# Altium schematic sheet KEY_V0.01_160620.SchDoc
size A4
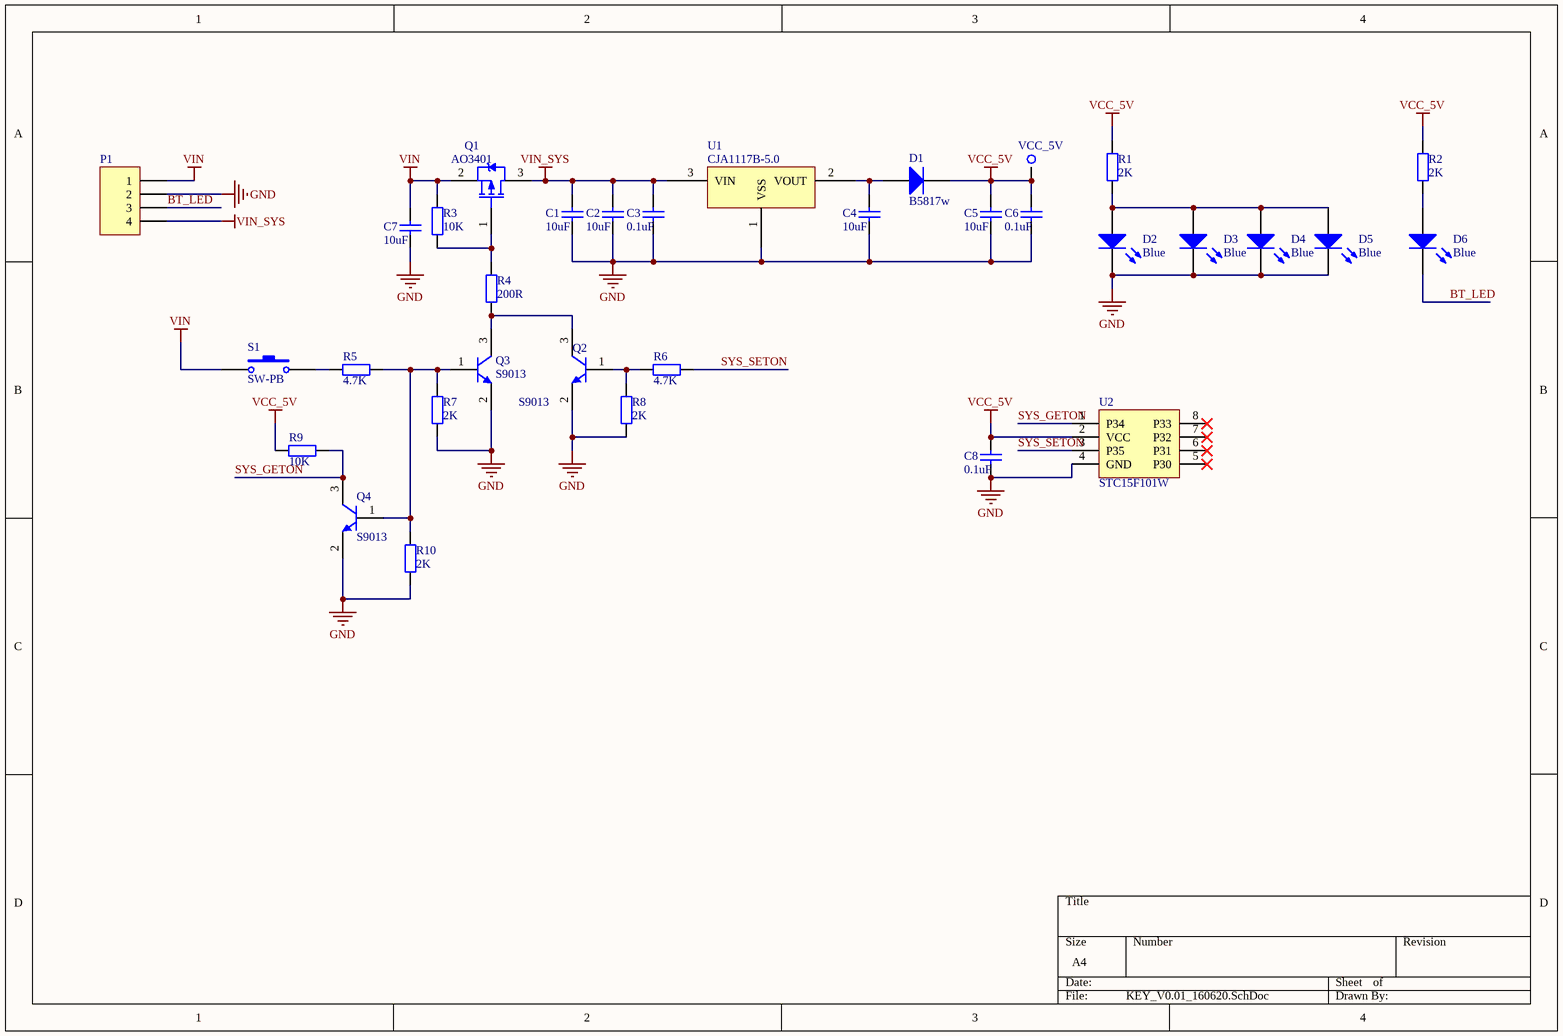
[diagram p0: KEY_V0.01_160620.SchDoc]

## Parts
C1  10uF  [C0603]
C2  10uF  [C0603]
C3  0.1uF  [C0603]
C4  10uF  [C0603]
C5  10uF  [C0603]
C6  0.1uF  [C0603]
C7  10uF  [C0603]
C8  0.1uF  [C0603]
D1  B5817w  [SOD-123]
D2  Blue  [D0603]
D3  Blue  [D0603]
D4  Blue  [D0603]
D5  Blue  [D0603]
D6  Blue  [D0603]
P1  Download_pad  [HEADER1X4/2.0MM_1]  (value not drawn)
Q1  AO3401  [SOT-23-3]
Q2  S9013  [SOT-23]
Q3  S9013  [SOT-23]
Q4  S9013  [SOT-23]
R1  2K  [R0603]
R2  2K  [R0603]
R3  10K  [R0603]
R4  200R  [R0603]
R5  4.7K  [R0603]
R6  4.7K  [R0603]
R7  2K  [R0603]
R8  2K  [R0603]
R9  10K  [R0603]
R10  2K  [R0603]
S1  SW-PB  [SW-TS-021]
U1  CJA1117B-5.0  [SOT-89-3L]
U2  STC15F101W  [SOP-8N]
VCC_5V  *  [Testpoint 1mm]  (value not drawn)

## Nets
GND: C1.2 C2.2 C3.2 C4.2 C5.2 C6.2 C7.2 C8.2 D2.2(K) D3.2(K) D4.2(K) D5.2(K) P1.2 Q2.2(E) Q3.2(E) Q4.2(E) R7.1 R8.1 R10.1 U1.1(VSS) U2.4(GND)
VCC_5V: C5.1 C6.1 C8.1 D1.2(K) R1.2 R2.1 R9.2 U2.2(VCC) VCC_5V.1
VIN: C7.1 P1.1 Q1.2(S) R3.2 S1.1
VIN_SYS: C1.1 C2.1 C3.1 P1.4 Q1.3(D) U1.3(VIN)
BT_LED: D6.2(K) P1.3
SYS_GETON: Q4.3(C) R9.1 U2.1(P34)
SYS_SETON: R6.1 U2.3(P35)
NetC4_1: C4.1 D1.1(A) U1.2(VOUT)
NetD2_1: D2.1(A) D3.1(A) D4.1(A) D5.1(A) R1.1
NetD6_1: D6.1(A) R2.2
NetQ1_1: Q1.1(G) R3.1 R4.2
NetQ2_1: Q2.1(B) R6.2 R8.2
NetQ2_3: Q2.3(C) Q3.3(C) R4.1
NetQ3_1: Q3.1(B) Q4.1(B) R5.1 R7.2 R10.2
NetR5_2: R5.2 S1.2

Not connected (* = marked no-connect by the designer): U2 5(P30)* 6(P31)* 7(P32)* 8(P33)*

## Library data of the parts
C1 C2 C4 C5 C7 = Cap: 三星 10uF 10% 16V C0603 X5R; 名称: 贴片电容
C3 C6 C8 = Cap: 三星 100nF 10% 25V C0603 X7R; 名称: 贴片电容
D1 = Diode 1N4002: 长电 B5817W SOD-123; 名称: 二极管
D2-D6 = LED0: 蓝箭 蓝灯高亮 0603 Blue-LED; 名称: LED
P1 = Header 4: AMP（国产仿制） AMP2.0mm-4Pin（板端） 间距2.00mm 卧插式 白色; 名称: wafer座
Q1 = PMOS: 名称: MOS管
Q2-Q4 = NPN_SMT: 名称: 三极管
R1 R2 R7 R8 R10 = Res2: 国巨 2K 1% R0603; 名称: 贴片电阻
R3 R9 = Res2: 国巨 10K 1% R0603; 名称: 贴片电阻
R4 = Res2: 国巨 200R 1% R0603; 名称: 贴片电阻
R5 R6 = Res2: 国巨 4.7K 1% R0603; 名称: 贴片电阻
S1 = SW-PB: 登鼎 3mm*6mm*2.5mm（长*宽*高） 贴片 白色按钮; 名称: 轻触开关
U1 = XC6206: 长电 三端稳压芯片 CJA1117B-3.3 3.3V 1A SOT-89-3L; 名称: LDO
U2 = STC15F101W: 宏晶 MCU STC15F101W SOP-8; 名称: MCU
VCC_5V = Testpoint